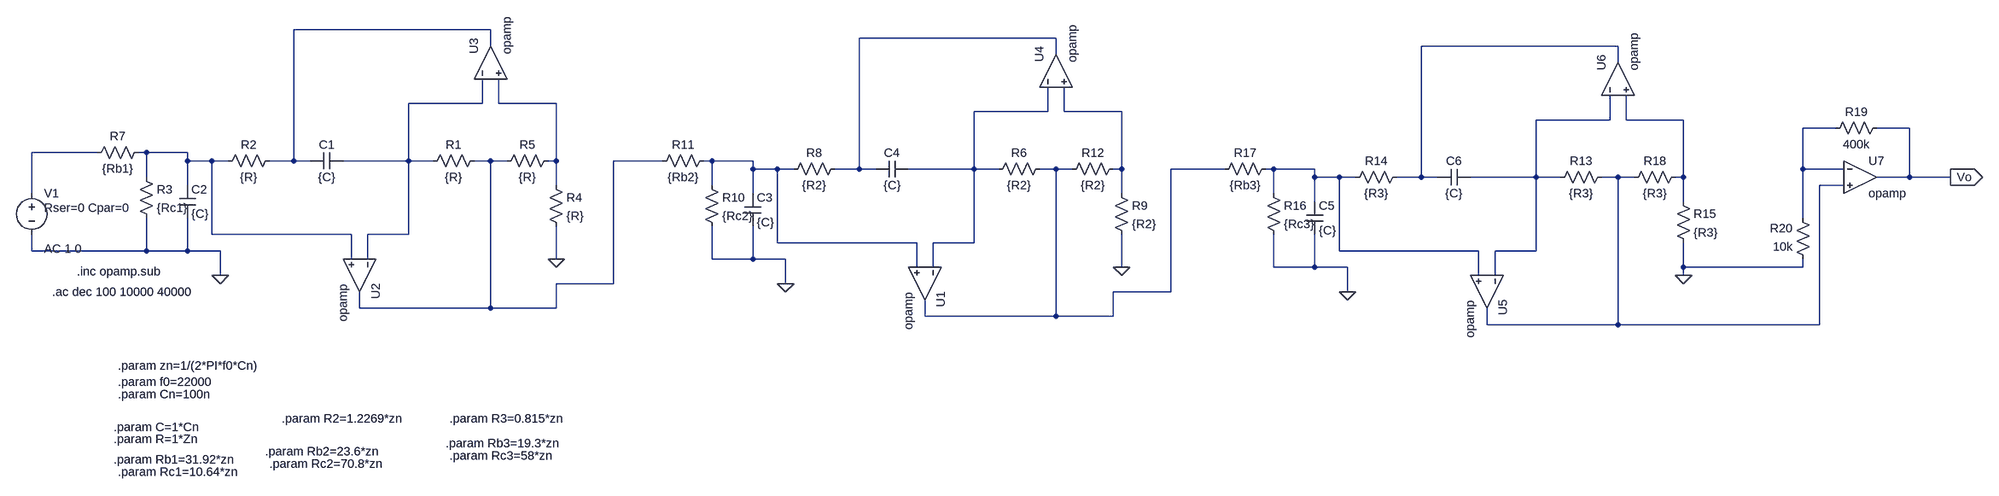
[diagram p0: schematic BPF_act.asc]
BPF_act.asc, the LTspice schematic file:
Version 4
SHEET 1 3784 1044
WIRE 752 128 368 128
WIRE 1856 144 1472 144
WIRE 752 160 752 128
WIRE 3040 160 2656 160
WIRE 1856 176 1856 144
WIRE 3040 192 3040 160
WIRE 736 272 736 224
WIRE 736 272 592 272
WIRE 768 272 768 224
WIRE 880 272 768 272
WIRE 1840 288 1840 240
WIRE 1840 288 1696 288
WIRE 1872 288 1872 240
WIRE 1984 288 1872 288
WIRE 3024 304 3024 256
WIRE 3024 304 2880 304
WIRE 3056 304 3056 256
WIRE 3168 304 3056 304
WIRE 3472 320 3408 320
WIRE 3616 320 3552 320
WIRE -16 368 -144 368
WIRE 80 368 64 368
WIRE 160 368 80 368
WIRE 160 384 160 368
WIRE 208 384 160 384
WIRE 240 384 208 384
WIRE 368 384 368 128
WIRE 368 384 320 384
WIRE 400 384 368 384
WIRE 592 384 592 272
WIRE 592 384 464 384
WIRE 640 384 592 384
WIRE 752 384 720 384
WIRE 784 384 752 384
WIRE 880 384 880 272
WIRE 880 384 864 384
WIRE 1088 384 992 384
WIRE 1184 384 1168 384
WIRE 1264 384 1184 384
WIRE 1264 400 1264 384
WIRE 1312 400 1264 400
WIRE 1344 400 1312 400
WIRE 1472 400 1472 144
WIRE 1472 400 1424 400
WIRE 1504 400 1472 400
WIRE 1696 400 1696 288
WIRE 1696 400 1568 400
WIRE 1744 400 1696 400
WIRE 1856 400 1824 400
WIRE 1888 400 1856 400
WIRE 1984 400 1984 288
WIRE 1984 400 1968 400
WIRE 2272 400 2080 400
WIRE 2368 400 2352 400
WIRE 2448 400 2368 400
WIRE 3408 400 3408 320
WIRE 3488 400 3408 400
WIRE 80 416 80 368
WIRE 2448 416 2448 400
WIRE 2496 416 2448 416
WIRE 2528 416 2496 416
WIRE 2656 416 2656 160
WIRE 2656 416 2608 416
WIRE 2688 416 2656 416
WIRE 2880 416 2880 304
WIRE 2880 416 2752 416
WIRE 2928 416 2880 416
WIRE 3040 416 3008 416
WIRE 3072 416 3040 416
WIRE 3168 416 3168 304
WIRE 3168 416 3152 416
WIRE 3616 416 3616 320
WIRE 3616 416 3552 416
WIRE 3696 416 3616 416
WIRE 160 432 160 384
WIRE 880 432 880 384
WIRE 1184 432 1184 384
WIRE 3488 432 3440 432
WIRE -144 448 -144 368
WIRE 1264 448 1264 400
WIRE 1984 448 1984 400
WIRE 2368 448 2368 400
WIRE 2448 464 2448 416
WIRE 3168 464 3168 416
WIRE 3408 496 3408 400
WIRE 208 528 208 384
WIRE 480 528 208 528
WIRE 592 528 592 384
WIRE 592 528 512 528
WIRE 1312 544 1312 400
WIRE 1584 544 1312 544
WIRE 1696 544 1696 400
WIRE 1696 544 1616 544
WIRE -144 560 -144 528
WIRE 80 560 80 496
WIRE 80 560 -144 560
WIRE 160 560 160 496
WIRE 160 560 80 560
WIRE 224 560 160 560
WIRE 2496 560 2496 416
WIRE 2768 560 2496 560
WIRE 2880 560 2880 416
WIRE 2880 560 2800 560
WIRE 480 576 480 528
WIRE 512 576 512 528
WIRE 880 576 880 512
WIRE 1184 576 1184 512
WIRE 1264 576 1264 512
WIRE 1264 576 1184 576
WIRE 1328 576 1264 576
WIRE 1584 592 1584 544
WIRE 1616 592 1616 544
WIRE 1984 592 1984 528
WIRE 2368 592 2368 528
WIRE 2448 592 2448 528
WIRE 2448 592 2368 592
WIRE 2512 592 2448 592
WIRE 3168 592 3168 544
WIRE 3408 592 3408 576
WIRE 3408 592 3168 592
WIRE 224 608 224 560
WIRE 2768 608 2768 560
WIRE 2800 608 2800 560
WIRE 3168 608 3168 592
WIRE 992 624 992 384
WIRE 992 624 880 624
WIRE 1328 624 1328 576
WIRE 2080 640 2080 400
WIRE 2080 640 1968 640
WIRE 2512 640 2512 592
WIRE 496 672 496 640
WIRE 752 672 752 384
WIRE 752 672 496 672
WIRE 880 672 880 624
WIRE 880 672 752 672
WIRE 1600 688 1600 656
WIRE 1856 688 1856 400
WIRE 1856 688 1600 688
WIRE 1968 688 1968 640
WIRE 1968 688 1856 688
WIRE 2784 704 2784 672
WIRE 3040 704 3040 416
WIRE 3040 704 2784 704
WIRE 3440 704 3440 432
WIRE 3440 704 3040 704
FLAG 224 608 0
FLAG 880 576 0
FLAG 1328 624 0
FLAG 1984 592 0
FLAG 2512 640 0
FLAG 3696 416 Vo
IOPIN 3696 416 Out
FLAG 3168 608 0
SYMBOL voltage -144 432 R0
WINDOW 123 24 124 Left 2
WINDOW 39 24 44 Left 2
SYMATTR Value2 AC 1 0
SYMATTR SpiceLine Rser=0 Cpar=0
SYMATTR InstName V1
SYMATTR Value ""
SYMBOL Opamps/opamp 560 608 R90
SYMATTR InstName U2
SYMBOL Opamps/opamp 688 192 R270
SYMATTR InstName U3
SYMBOL res 624 400 R270
WINDOW 0 32 56 VTop 2
WINDOW 3 0 56 VBottom 2
SYMATTR InstName R1
SYMATTR Value {R}
SYMBOL res 336 368 R90
WINDOW 0 0 56 VBottom 2
WINDOW 3 32 56 VTop 2
SYMATTR InstName R2
SYMATTR Value {R}
SYMBOL res 864 416 R0
SYMATTR InstName R4
SYMATTR Value {R}
SYMBOL cap 144 432 R0
SYMATTR InstName C2
SYMATTR Value {C}
SYMBOL res 64 400 R0
SYMATTR InstName R3
SYMATTR Value {Rc1}
SYMBOL res 80 352 R90
WINDOW 0 0 56 VBottom 2
WINDOW 3 32 56 VTop 2
SYMATTR InstName R7
SYMATTR Value {Rb1}
SYMBOL cap 464 368 R90
WINDOW 0 0 32 VBottom 2
WINDOW 3 32 32 VTop 2
SYMATTR InstName C1
SYMATTR Value {C}
SYMBOL res 880 368 R90
WINDOW 0 0 56 VBottom 2
WINDOW 3 32 56 VTop 2
SYMATTR InstName R5
SYMATTR Value {R}
SYMBOL Opamps/opamp 1664 624 R90
SYMATTR InstName U1
SYMBOL Opamps/opamp 1792 208 R270
SYMATTR InstName U4
SYMBOL res 1728 416 R270
WINDOW 0 32 56 VTop 2
WINDOW 3 0 56 VBottom 2
SYMATTR InstName R6
SYMATTR Value {R2}
SYMBOL res 1440 384 R90
WINDOW 0 0 56 VBottom 2
WINDOW 3 32 56 VTop 2
SYMATTR InstName R8
SYMATTR Value {R2}
SYMBOL res 1968 432 R0
SYMATTR InstName R9
SYMATTR Value {R2}
SYMBOL cap 1248 448 R0
SYMATTR InstName C3
SYMATTR Value {C}
SYMBOL res 1168 416 R0
SYMATTR InstName R10
SYMATTR Value {Rc2}
SYMBOL res 1184 368 R90
WINDOW 0 0 56 VBottom 2
WINDOW 3 32 56 VTop 2
SYMATTR InstName R11
SYMATTR Value {Rb2}
SYMBOL cap 1568 384 R90
WINDOW 0 0 32 VBottom 2
WINDOW 3 32 32 VTop 2
SYMATTR InstName C4
SYMATTR Value {C}
SYMBOL res 1984 384 R90
WINDOW 0 0 56 VBottom 2
WINDOW 3 32 56 VTop 2
SYMATTR InstName R12
SYMATTR Value {R2}
SYMBOL Opamps/opamp 2848 640 R90
SYMATTR InstName U5
SYMBOL Opamps/opamp 2976 224 R270
SYMATTR InstName U6
SYMBOL res 2912 432 R270
WINDOW 0 32 56 VTop 2
WINDOW 3 0 56 VBottom 2
SYMATTR InstName R13
SYMATTR Value {R3}
SYMBOL res 2624 400 R90
WINDOW 0 0 56 VBottom 2
WINDOW 3 32 56 VTop 2
SYMATTR InstName R14
SYMATTR Value {R3}
SYMBOL res 3152 448 R0
SYMATTR InstName R15
SYMATTR Value {R3}
SYMBOL cap 2432 464 R0
SYMATTR InstName C5
SYMATTR Value {C}
SYMBOL res 2352 432 R0
SYMATTR InstName R16
SYMATTR Value {Rc3}
SYMBOL res 2368 384 R90
WINDOW 0 0 56 VBottom 2
WINDOW 3 32 56 VTop 2
SYMATTR InstName R17
SYMATTR Value {Rb3}
SYMBOL cap 2752 400 R90
WINDOW 0 0 32 VBottom 2
WINDOW 3 32 32 VTop 2
SYMATTR InstName C6
SYMATTR Value {C}
SYMBOL res 3168 400 R90
WINDOW 0 0 56 VBottom 2
WINDOW 3 32 56 VTop 2
SYMATTR InstName R18
SYMATTR Value {R3}
SYMBOL Opamps/opamp 3520 352 R0
SYMATTR InstName U7
SYMBOL res 3568 304 R90
WINDOW 0 0 56 VBottom 2
WINDOW 3 32 56 VTop 2
SYMATTR InstName R19
SYMATTR Value 400k
SYMBOL res 3424 592 R180
WINDOW 0 36 76 Left 2
WINDOW 3 36 40 Left 2
SYMATTR InstName R20
SYMATTR Value 10k
TEXT -104 640 Left 2 !.ac dec 100 10000 40000
TEXT -56 600 Left 2 !.inc opamp.sub
TEXT 16 904 Left 2 !.param C=1*Cn
TEXT 16 928 Left 2 !.param R=1*Zn
TEXT 344 888 Left 2 !.param R2=1.2269*zn
TEXT 672 888 Left 2 !.param R3=0.815*zn
TEXT 16 968 Left 2 !.param Rb1=31.92*zn
TEXT 24 992 Left 2 !.param Rc1=10.64*zn
TEXT 312 952 Left 2 !.param Rb2=23.6*zn
TEXT 320 976 Left 2 !.param Rc2=70.8*zn
TEXT 664 936 Left 2 !.param Rb3=19.3*zn
TEXT 672 960 Left 2 !.param Rc3=58*zn
TEXT 24 816 Left 2 !.param f0=22000
TEXT 24 840 Left 2 !.param Cn=100n
TEXT 24 784 Left 2 !.param zn=1/(2*PI*f0*Cn)

The netlist it stands for:
* BPF_act.asc
V1 N011 0 AC 1 0 Rser=0 Cpar=0
XU2 N004 N012 N013 opamp Aol=100K GBW=10Meg  ; pins invin noninvin out
XU3 N004 N005 N001 opamp Aol=100K GBW=10Meg  ; pins invin noninvin out
R1 N004 N013 {R}
R2 N001 N012 {R}
R4 N005 0 {R}
C2 N012 0 {C}
R3 N012 0 {Rc1}
R7 N012 N011 {Rb1}
C1 N004 N001 {C}
R5 N005 N013 {R}
XU1 N006 N014 N015 opamp Aol=100K GBW=10Meg  ; pins invin noninvin out
XU4 N006 N007 N002 opamp Aol=100K GBW=10Meg  ; pins invin noninvin out
R6 N006 N015 {R2}
R8 N002 N014 {R2}
R9 N007 0 {R2}
C3 N014 0 {C}
R10 N014 0 {Rc2}
R11 N014 N013 {Rb2}
C4 N006 N002 {C}
R12 N007 N015 {R2}
XU5 N008 N016 N017 opamp Aol=100K GBW=10Meg  ; pins invin noninvin out
XU6 N008 N009 N003 opamp Aol=100K GBW=10Meg  ; pins invin noninvin out
R13 N008 N017 {R3}
R14 N003 N016 {R3}
R15 N009 0 {R3}
C5 N016 0 {C}
R16 N016 0 {Rc3}
R17 N016 N015 {Rb3}
C6 N008 N003 {C}
R18 N009 N017 {R3}
XU7 N010 N017 Vo opamp Aol=100K GBW=10Meg  ; pins invin noninvin out
R19 Vo N010 400k
R20 0 N010 10k
.ac dec 100 10000 40000
.inc opamp.sub
.param C=1*Cn
.param R=1*Zn
.param R2=1.2269*zn
.param R3=0.815*zn
.param Rb1=31.92*zn
.param Rc1=10.64*zn
.param Rb2=23.6*zn
.param Rc2=70.8*zn
.param Rb3=19.3*zn
.param Rc3=58*zn
.param f0=22000
.param Cn=100n
.param zn=1/(2*PI*f0*Cn)
.backanno
.end